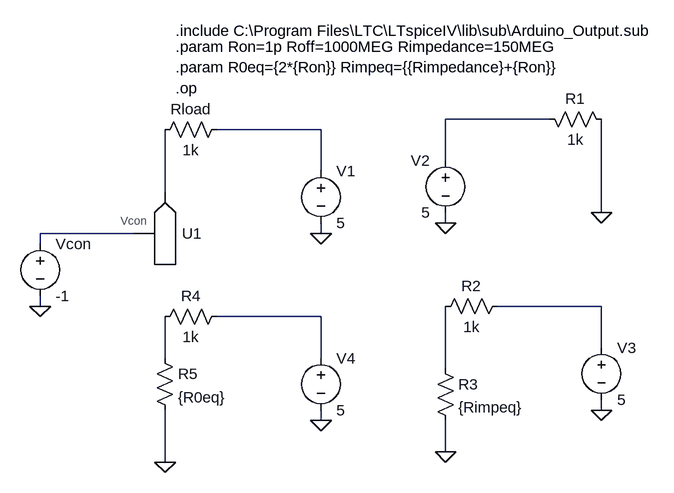
[diagram p0: schematic Arduino_Output_Test.asc]
Arduino_Output_Test.asc, the LTspice schematic file:
Version 4
SHEET 1 1540 680
WIRE 992 128 832 128
WIRE 640 144 480 144
WIRE 832 192 832 128
WIRE 640 208 640 144
WIRE 400 240 400 144
WIRE 1072 272 1072 128
WIRE 832 288 832 272
WIRE 352 304 208 304
WIRE 640 304 640 288
WIRE 208 320 208 304
WIRE 208 416 208 400
WIRE 1072 416 912 416
WIRE 640 432 480 432
WIRE 1072 480 1072 416
WIRE 400 496 400 432
WIRE 640 496 640 432
WIRE 832 512 832 416
WIRE 1072 576 1072 560
WIRE 640 592 640 576
WIRE 832 640 832 592
WIRE 400 656 400 576
FLAG 640 304 0
FLAG 1072 576 0
FLAG 832 640 0
FLAG 640 592 0
FLAG 400 656 0
FLAG 208 416 0
FLAG 832 288 0
FLAG 1072 272 0
SYMBOL voltage 640 192 R0
WINDOW 123 0 0 Left 2
WINDOW 39 0 0 Left 2
SYMATTR InstName V1
SYMATTR Value 5
SYMBOL res 496 128 R90
WINDOW 0 0 56 VBottom 2
WINDOW 3 32 56 VTop 2
SYMATTR InstName Rload
SYMATTR Value 1k
SYMBOL voltage 1072 464 R0
WINDOW 123 0 0 Left 2
WINDOW 39 0 0 Left 2
SYMATTR InstName V3
SYMATTR Value 5
SYMBOL res 928 400 R90
WINDOW 0 0 56 VBottom 2
WINDOW 3 32 56 VTop 2
SYMATTR InstName R2
SYMATTR Value 1k
SYMBOL res 816 496 R0
SYMATTR InstName R3
SYMATTR Value {Rimpeq}
SYMBOL voltage 640 480 R0
WINDOW 123 0 0 Left 2
WINDOW 39 0 0 Left 2
SYMATTR InstName V4
SYMATTR Value 5
SYMBOL res 496 416 R90
WINDOW 0 0 56 VBottom 2
WINDOW 3 32 56 VTop 2
SYMATTR InstName R4
SYMATTR Value 1k
SYMBOL res 384 480 R0
SYMATTR InstName R5
SYMATTR Value {R0eq}
SYMBOL voltage 208 304 R0
WINDOW 123 0 0 Left 2
WINDOW 39 0 0 Left 2
SYMATTR InstName Vcon
SYMATTR Value -1
SYMBOL voltage 832 176 M0
WINDOW 123 0 0 Left 2
WINDOW 39 0 0 Left 2
SYMATTR InstName V2
SYMATTR Value 5
SYMBOL res 976 112 M90
WINDOW 0 0 56 VBottom 2
WINDOW 3 32 56 VTop 2
SYMATTR InstName R1
SYMATTR Value 1k
SYMBOL mysymbols\\Arduino_Output 384 336 R0
SYMATTR InstName U1
TEXT 416 16 Left 2 !.param Ron=1p Roff=1000MEG Rimpedance=150MEG
TEXT 416 80 Left 2 !.op
TEXT 416 48 Left 2 !.param R0eq={2*{Ron}} Rimpeq={{Rimpedance}+{Ron}}
TEXT 416 -8 Left 2 !.include C:\\Program Files\\LTC\\LTspiceIV\\lib\\sub\\Arduino_Output.sub

The netlist it stands for:
* Arduino_Output_Test.asc
V1 N002 0 5
Rload N002 N003 1k
V3 N005 0 5
R2 N005 N008 1k
R3 N008 0 {Rimpeq}
V4 N006 0 5
R4 N006 N007 1k
R5 N007 0 {R0eq}
Vcon N004 0 -1
V2 N001 0 5
R1 N001 0 1k
XU1 N004 N003 arduino_output  ; pins Vcon Output
.param Ron=1p Roff=1000MEG Rimpedance=150MEG
.op
.param R0eq={2*{Ron}} Rimpeq={{Rimpedance}+{Ron}}
.include C:\Program Files\LTC\LTspiceIV\lib\sub\Arduino_Output.sub
.backanno
.end